# Altium schematic sheet PowerSupply.SchDoc: РППУ
size 420 x 297 mm; ApprovedBy: Коровин; CheckedBy: Коровин; DrawnBy: Овчинников; DocumentNumber: ВКА.821011.000.ПЗ; Scale: {Мш.}; PageSetup: Record=PageOptions|CenterHorizontal=False|CenterVertical=False|PrintScale=0.70|XCorrection=0.00|YCorrection=0.00|PrintKind=1|BorderSize=5000000|LeftOffset=0|BottomOffset=0|Orientation=2|PaperLength=1000|PaperWidth=1000|Scale=100|PaperSource=15|PrintQuality=-3|MediaType=1|DitherType=10|PrintScaleMode=1|PaperKind=A4|PaperIndex=9; Mass: {М.}; DocumentType: Схема электрическая; Rule: PcbType=ProtelPcb
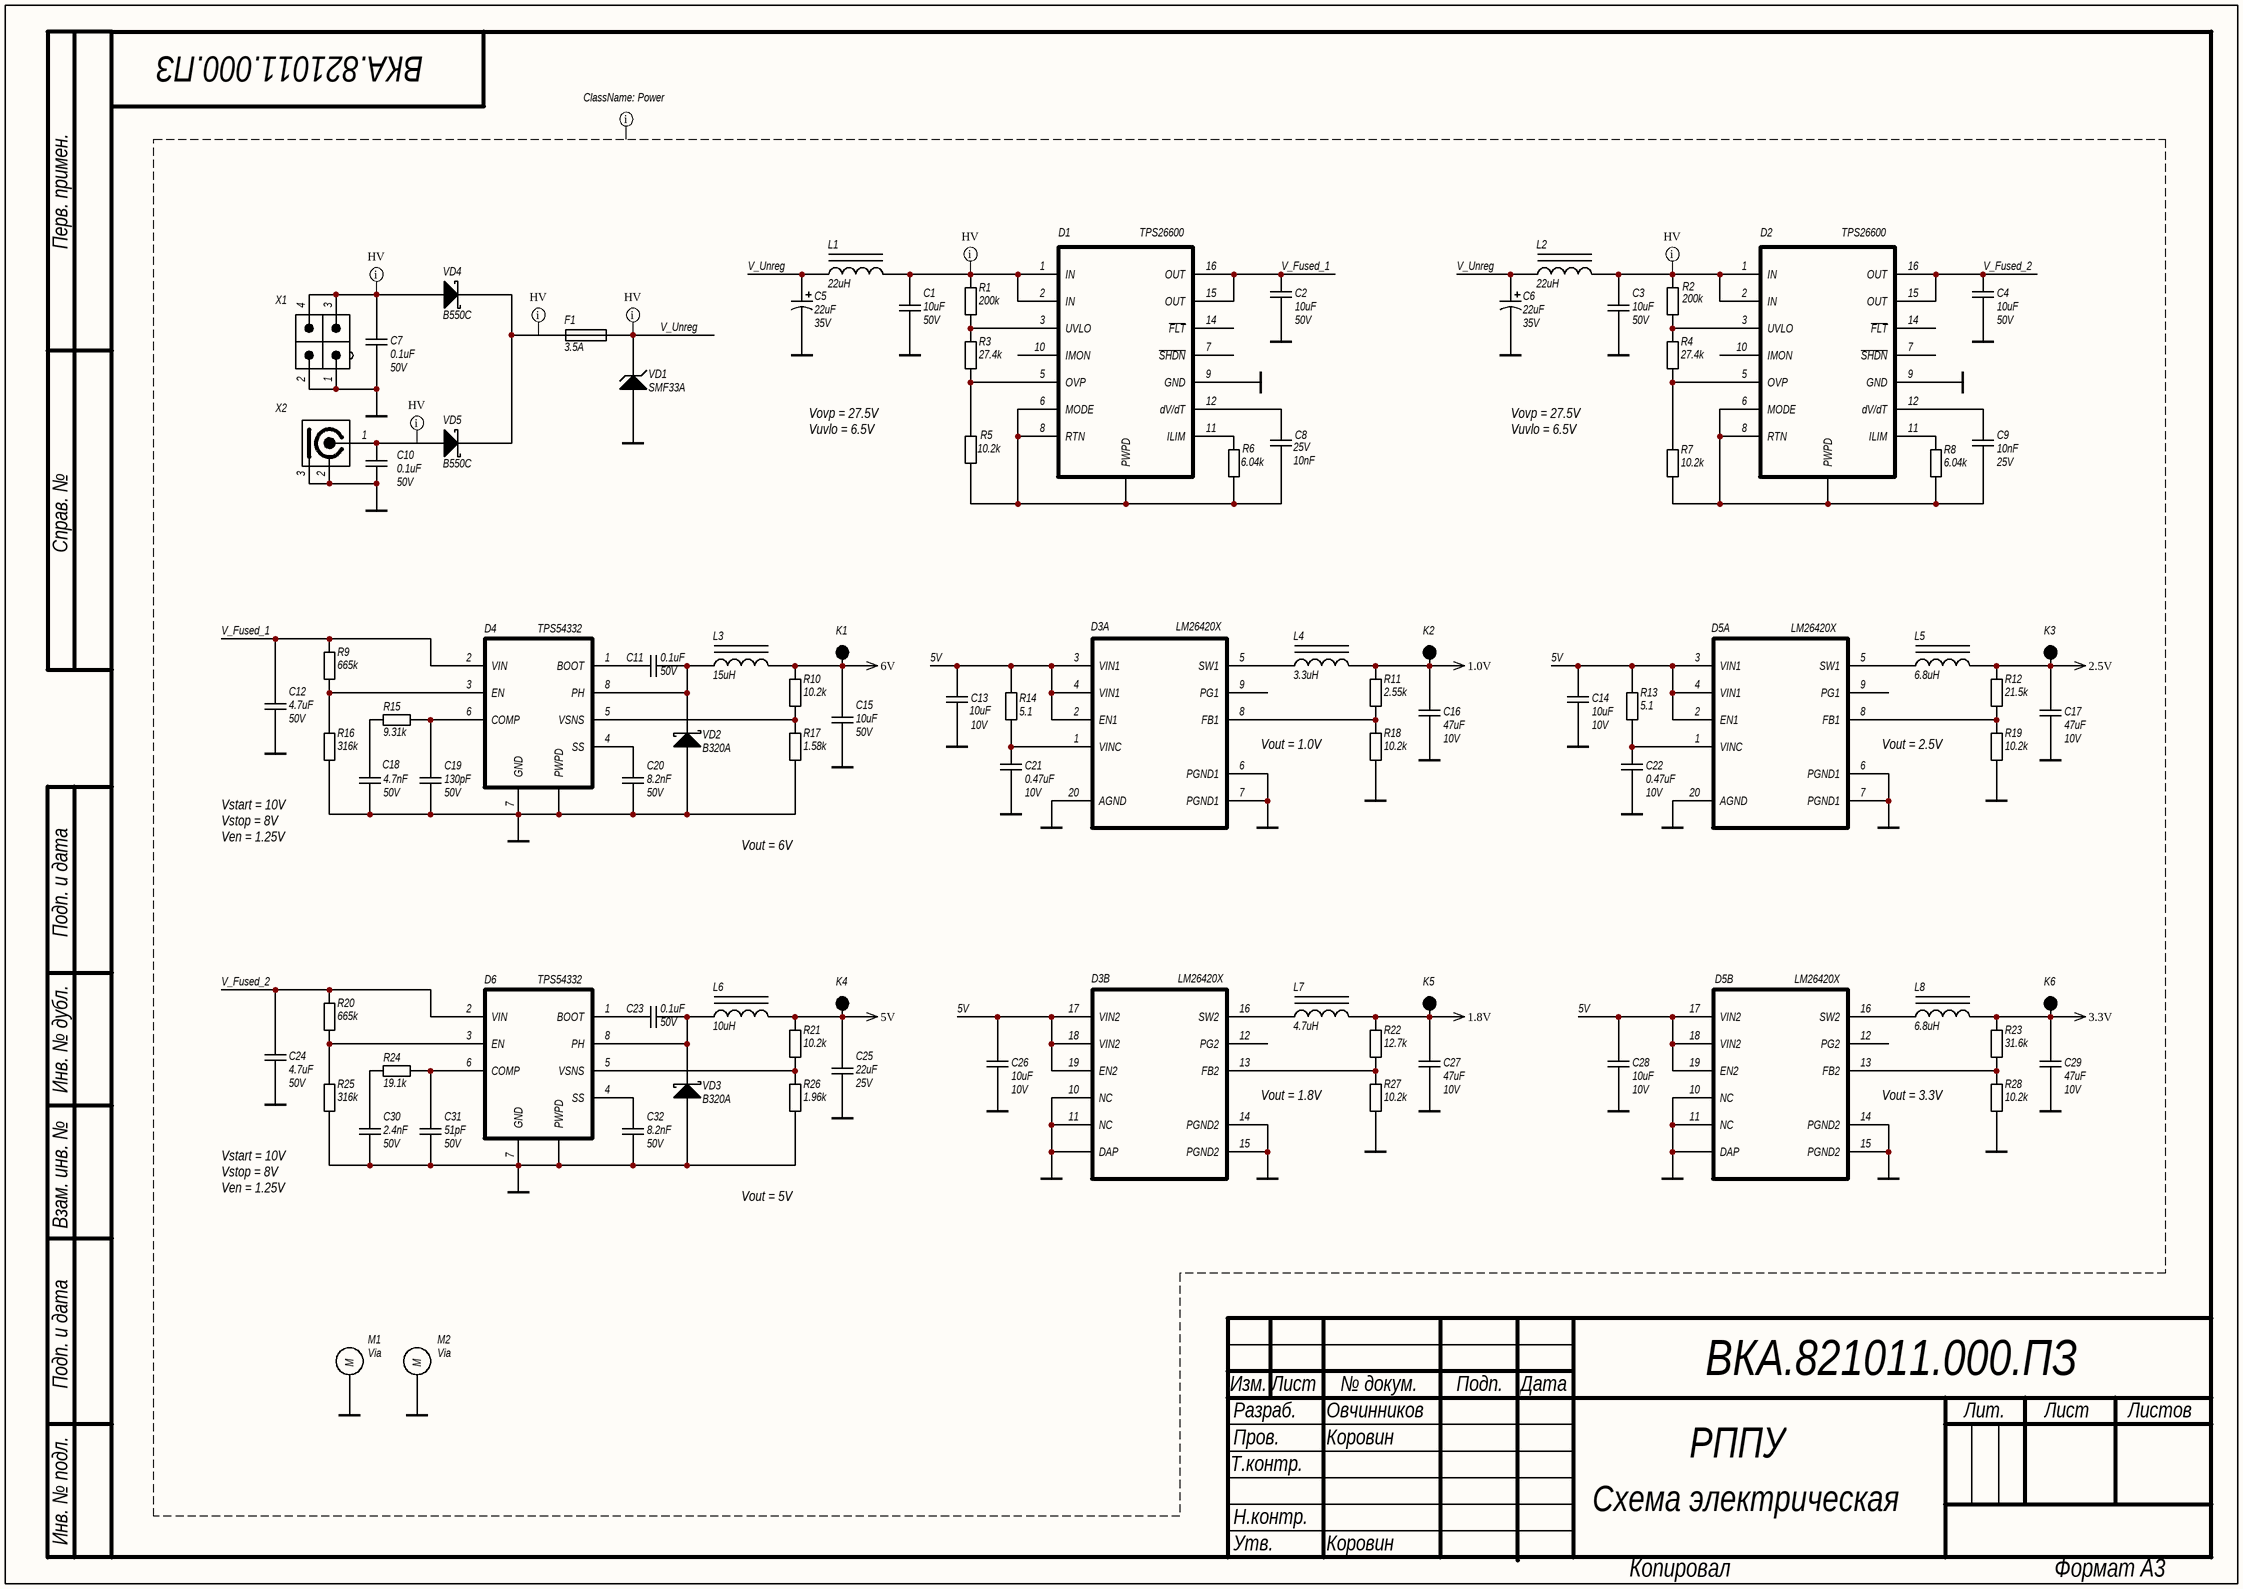
[diagram p0: PowerSupply.SchDoc]

## Parts
C1  value 10uF  Voltage: 50V  [C1210]  (hidden comment: CAP uF)
C2  value 10uF  Voltage: 50V  [C1210]  (hidden comment: CAP uF)
C3  value 10uF  Voltage: 50V  [C1210]  (hidden comment: CAP uF)
C4  value 10uF  Voltage: 50V  [C1210]  (hidden comment: CAP uF)
C5  value 22uF  Voltage: 35V  [Tantalum_D]  (hidden comment: Cap Polarity)
C6  value 22uF  Voltage: 35V  [Tantalum_D]  (hidden comment: Cap Polarity)
C7  value 0.1uF  Voltage: 50V  [C0402]  (hidden comment: CAP)
C8  value 10nF  Voltage: 25V  [C0402]  (hidden comment: CAP)
C9  value 10nF  Voltage: 25V  [C0402]  (hidden comment: CAP)
C10  value 0.1uF  Voltage: 50V  [C0402]  (hidden comment: CAP)
C11  value 0.1uF  Voltage: 50V  [C0402]  (hidden comment: CAP)
C12  value 4.7uF  Voltage: 50V  [C0805]  (hidden comment: CAP uF)
C13  value 10uF  Voltage: 10V  [C0805]  (hidden comment: CAP uF)
C14  value 10uF  Voltage: 10V  [C0805]  (hidden comment: CAP uF)
C15  value 10uF  Voltage: 50V  [C1210]  (hidden comment: CAP uF)
C16  value 47uF  Voltage: 10V  [C1210]  (hidden comment: CAP uF)
C17  value 47uF  Voltage: 10V  [C1210]  (hidden comment: CAP uF)
C18  value 4.7nF  Voltage: 50V  [C0603]  (hidden comment: CAP)
C19  value 130pF  Voltage: 50V  [C0402]  (hidden comment: CAP)
C20  value 8.2nF  Voltage: 50V  [C0402]  (hidden comment: CAP)
C21  value 0.47uF  Voltage: 10V  [C0603]  (hidden comment: CAP)
C22  value 0.47uF  Voltage: 10V  [C0603]  (hidden comment: CAP)
C23  value 0.1uF  Voltage: 50V  [C0402]  (hidden comment: CAP)
C24  value 4.7uF  Voltage: 50V  [C0805]  (hidden comment: CAP uF)
C25  value 22uF  Voltage: 25V  [C1210]  (hidden comment: CAP uF)
C26  value 10uF  Voltage: 10V  [C0805]  (hidden comment: CAP uF)
C27  value 47uF  Voltage: 10V  [C1210]  (hidden comment: CAP uF)
C28  value 10uF  Voltage: 10V  [C0805]  (hidden comment: CAP uF)
C29  value 47uF  Voltage: 10V  [C1210]  (hidden comment: CAP uF)
C30  value 2.4nF  Voltage: 50V  [C0603]  (hidden comment: CAP)
C31  value 51pF  Voltage: 50V  [C0402]  (hidden comment: CAP)
C32  value 8.2nF  Voltage: 50V  [C0402]  (hidden comment: CAP)
D1  TPS26600  [R-PDSO-G16]
D2  TPS26600  [R-PDSO-G16]
D3  LM26420X  [HTSSOP-20]  (parts A,B of 2)
D4  TPS54332  [R-PDSO-G8]
D5  LM26420X  [HTSSOP-20]  (parts A,B of 2)
D6  TPS54332  [R-PDSO-G8]
F1  Current: 3.5A  [Fuse]  (hidden comment: FUSE)
K1  6V  [Control Point]  (value not drawn)
K2  1.0V  [Control Point]  (value not drawn)
K3  2.5V  [Control Point]  (value not drawn)
K4  5V  [Control Point]  (value not drawn)
K5  1.8V  [Control Point]  (value not drawn)
K6  3.3V  [Control Point]  (value not drawn)
L1  value 22uH  [XAL6060-223]  (hidden comment: Inductor PWR)
L2  value 22uH  [XAL6060-223]  (hidden comment: Inductor PWR)
L3  value 15uH  [XAL5050]  (hidden comment: Inductor PWR)
L4  value 3.3uH  [XAL4030]  (hidden comment: Inductor PWR)
L5  value 6.8uH  [XAL4030]  (hidden comment: Inductor PWR)
L6  value 10uH  [XAL5050]  (hidden comment: Inductor PWR)
L7  value 4.7uH  [XAL4030]  (hidden comment: Inductor PWR)
L8  value 6.8uH  [XAL4030]  (hidden comment: Inductor PWR)
M1  Via  [Mechanical_Via]
M2  Via  [Mechanical_Via]
R1  value 200k  [R0402]  (hidden comment: RES)
R2  value 200k  [R0402]  (hidden comment: RES)
R3  value 27.4k  [R0402]  (hidden comment: RES)
R4  value 27.4k  [R0402]  (hidden comment: RES)
R5  value 10.2k  [R0402]  (hidden comment: RES)
R6  value 6.04k  [R0402]  (hidden comment: RES)
R7  value 10.2k  [R0402]  (hidden comment: RES)
R8  value 6.04k  [R0402]  (hidden comment: RES)
R9  value 665k  [R0402]  (hidden comment: RES)
R10  value 10.2k  [R0402]  (hidden comment: RES)
R11  value 2.55k  [R0402]  (hidden comment: RES)
R12  value 21.5k  [R0402]  (hidden comment: RES)
R13  value 5.1  [R0402]  (hidden comment: RES)
R14  value 5.1  [R0402]  (hidden comment: RES)
R15  value 9.31k  [R0402]  (hidden comment: RES)
R16  value 316k  [R0402]  (hidden comment: RES)
R17  value 1.58k  [R0402]  (hidden comment: RES)
R18  value 10.2k  [R0402]  (hidden comment: RES)
R19  value 10.2k  [R0402]  (hidden comment: RES)
R20  value 665k  [R0402]  (hidden comment: RES)
R21  value 10.2k  [R0402]  (hidden comment: RES)
R22  value 12.7k  [R0402]  (hidden comment: RES)
R23  value 31.6k  [R0402]  (hidden comment: RES)
R24  value 19.1k  [R0402]  (hidden comment: RES)
R25  value 316k  [R0402]  (hidden comment: RES)
R26  value 1.96k  [R0402]  (hidden comment: RES)
R27  value 10.2k  [R0402]  (hidden comment: RES)
R28  value 10.2k  [R0402]  (hidden comment: RES)
VD1  SMF33A  [SOD-123F]
VD2  B320A  [Diode_SMA]
VD3  B320A  [Diode_SMA]
VD4  B550C  [Diode_SMC]
VD5  B550C  [Diode_SMC]
X1  miniFit  [2x2 PWR_HDR]  (value not drawn)
X2  POWER  [DC_CONNECTOR]  (value not drawn)

## Nets
1.0V: C16.2 K2.1 L4.2 R11.2
1.8V: C27.2 K5.1 L7.2 R22.2
2.5V: C17.2 K3.1 L5.2 R12.2
3.3V: C29.2 K6.1 L8.2 R23.2
5V: C13.2 C14.2 C25.2 C26.2 C28.2 D3.2(EN1) D3.3(VIN1) D3.4(VIN1) D3.17(VIN2) D3.18(VIN2) D3.19(EN2) D5.2(EN1) D5.3(VIN1) D5.4(VIN1) D5.17(VIN2) D5.18(VIN2) D5.19(EN2) K4.1 L6.2 R13.2 R14.1 R21.2
6V: C15.2 K1.1 L3.2 R10.2
GND: C1.1 C2.1 C3.1 C4.1 C5.2 C6.2 C7.1 C10.1 C12.1 C13.1 C14.1 C15.1 C16.1 C17.1 C18.2 C19.1 C20.1 C21.2 C22.1 C24.1 C25.1 C26.1 C27.1 C28.1 C29.1 C30.1 C31.1 C32.1 D1.9(GND) D2.9(GND) D3.6(PGND1) D3.7(PGND1) D3.10(NC) D3.11(NC) D3.14(PGND2) D3.15(PGND2) D3.20(AGND) D3.21(DAP) D4.7(GND) D4.9(PWPD) D5.6(PGND1) D5.7(PGND1) D5.10(NC) D5.11(NC) D5.14(PGND2) D5.15(PGND2) D5.20(AGND) D5.21(DAP) D6.7(GND) D6.9(PWPD) M1.0(M) M2.0(M) R16.1 R17.1 R18.1 R19.1 R25.1 R26.1 R27.1 R28.1 VD1.2(A) VD2.2(A) VD3.2(A) X1.1 X1.2 X2.2(GND) X2.3(GND)
V_Fused_1: C2.2 C12.2 D1.15(OUT) D1.16(OUT) D4.2(VIN) R9.2
V_Fused_2: C4.2 C24.2 D2.15(OUT) D2.16(OUT) D6.2(VIN) R20.2
V_Unreg: C5.1 C6.1 F1.2 L1.1 L2.1 VD1.1(K)
NetC1_2: C1.2 D1.1(IN) D1.2(IN) L1.2 R1.2
NetC3_2: C3.2 D2.1(IN) D2.2(IN) L2.2 R2.1
NetC7_2: C7.2 VD4.2(A) X1.3 X1.4
NetC8_1: C8.1 D1.6(MODE) D1.8(RTN) D1.17(PWPD) R5.2 R6.1
NetC8_2: C8.2 D1.12(dV/dT)
NetC9_1: C9.1 D2.6(MODE) D2.8(RTN) D2.17(PWPD) R7.1 R8.1
NetC9_2: C9.2 D2.12(dV/dT)
NetC10_2: C10.2 VD5.2(A) X2.1(RF)
NetC11_1: C11.1 D4.8(PH) L3.1 VD2.1(K)
NetC11_2: C11.2 D4.1(BOOT)
NetC18_1: C18.1 R15.1
NetC19_2: C19.2 D4.6(COMP) R15.2
NetC20_2: C20.2 D4.4(SS)
NetC21_1: C21.1 D3.1(VINC) R14.2
NetC22_2: C22.2 D5.1(VINC) R13.1
NetC23_1: C23.1 D6.8(PH) L6.1 VD3.1(K)
NetC23_2: C23.2 D6.1(BOOT)
NetC30_2: C30.2 R24.2
NetC31_2: C31.2 D6.6(COMP) R24.1
NetC32_2: C32.2 D6.4(SS)
NetD1_3: D1.3(UVLO) R1.1 R3.2
NetD1_5: D1.5(OVP) R3.1 R5.1
NetD1_11: D1.11(ILIM) R6.2
NetD2_3: D2.3(UVLO) R2.2 R4.2
NetD2_5: D2.5(OVP) R4.1 R7.2
NetD2_11: D2.11(ILIM) R8.2
NetD3_5: D3.5(SW1) L4.1
NetD3_8: D3.8(FB1) R11.1 R18.2
NetD3_13: D3.13(FB2) R22.1 R27.2
NetD3_16: D3.16(SW2) L7.1
NetD4_3: D4.3(EN) R9.1 R16.2
NetD4_5: D4.5(VSNS) R10.1 R17.2
NetD5_5: D5.5(SW1) L5.1
NetD5_8: D5.8(FB1) R12.1 R19.2
NetD5_13: D5.13(FB2) R23.1 R28.2
NetD5_16: D5.16(SW2) L8.1
NetD6_3: D6.3(EN) R20.1 R25.2
NetD6_5: D6.5(VSNS) R21.1 R26.2
NetF1_1: F1.1 VD4.1(K) VD5.1(K)

Not connected (* = marked no-connect by the designer): D1 7(~{SHDN}) 10(IMON) 14(~{FLT}); D2 7(~{SHDN}) 10(IMON) 14(~{FLT}); D3 9(PG1) 12(PG2); D5 9(PG1) 12(PG2)

## Layout directives
net class Power: 1.0V, 1.8V, 2.5V, 3.3V, 5V, 6V, GND, V_Fused_1, V_Fused_2, V_Unreg
net class HV: NetC1_2, NetC3_2, NetC7_2, NetC10_2, NetF1_1, V_Unreg

## Notes on the sheet
- Vovp = 27.5V
  Vuvlo = 6.5V
- Vout = 1.0V
- Vout = 2.5V
- Vstart = 10V
  Vstop = 8V
  Ven = 1.25V
- Vout = 6V
- Vout = 1.8V
- Vout = 3.3V
- Vout = 5V
- Перв. примен.
- Справ. №
- Подп. и дата
- Инв. № дубл.
- Взам. инв. №
- Изм.
- Лист
- № докум.
- Подп.
- Дата
- Т.контр.
- Пров.
- Разраб.
- Лит.
- Листов
- Инв. № подл.
- Н.контр.
- Утв.
- Копировал
- Формат А3

## Library data of the parts
C1-C4 C15 = CAP uF: SMD Capacitor; Manufacturer: Murata; Material: X7R; Tolerance: 10%; Type: Ceramic Capacitor; P/N: GRM32ER71H106KA12L
C5 C6 = Cap Polarity: Tantalum Polarity SMD Capacitor; Manufacturer: AVX Corporation; Name: Tantalum Capacitor; Tolerance: 10%; Type: Tantalum Polarity Cap; P/N: TPSD226K035R0200; Temperature Range: -55…85°C
C7 C10 C11 C23 = CAP: SMD Capacitor; Manufacturer: Murata; Material: X7R; Tolerance: 10%; Type: Ceramic Capacitor; P/N: GRM155R71H104KE14J
C8 C9 = CAP: SMD Capacitor; Manufacturer: Murata; Material: X7R; Tolerance: 5%; Type: Ceramic Capacitor; P/N: GRM155R71E103KA01D
C12 C24 = CAP uF: SMD Capacitor; Manufacturer: Murata; Material: X5R; Tolerance: 20%; Type: Ceramic Capacitor; P/N: GRM21BR61H475KE51L
C13 C14 C26 C28 = CAP uF: SMD Capacitor; Manufacturer: Murata; Material: X5R; Tolerance: 10%; Type: Ceramic Capacitor; P/N: GRM21BR71A106KE51L
C16 C17 C27 C29 = CAP uF: SMD Capacitor; Manufacturer: Murata; Material: X7R; Tolerance: 10%; Type: Ceramic Capacitor; P/N: GRM32ER71A476KE15L
C18 = CAP: SMD Capacitor; Manufacturer: Murata; Material: NP0; Tolerance: 5%; Type: Ceramic Capacitor; P/N: GRM1885C1H472JA01D
C19 = CAP: SMD Capacitor; Manufacturer: Murata; Material: NP0; Tolerance: 5%; Type: Ceramic Capacitor; P/N: GRM1555C1H131JA01D
C20 C32 = CAP: SMD Capacitor; Manufacturer: Murata; Material: X7R; Tolerance: 10%; Type: Ceramic Capacitor; P/N: GRM155R71H822KA88D
C21 C22 = CAP: SMD Capacitor; Manufacturer: Murata; Material: X7R; Tolerance: 10%; Type: Ceramic Capacitor; P/N: GRM188R71A474KA61D
C25 = CAP uF: SMD Capacitor; Manufacturer: Murata; Material: X7R; Tolerance: 10%; Type: Ceramic Capacitor; P/N: GRM32ER71E226KE15L
C30 = CAP: SMD Capacitor; Manufacturer: Murata; Material: NP0; Tolerance: 5%; Type: Ceramic Capacitor; P/N: GRM1885C1H242JA01D
C31 = CAP: SMD Capacitor; Manufacturer: Murata; Material: NP0; Tolerance: 5%; Type: Ceramic Capacitor; P/N: GRM1555C1H510JA01D
D1 D2 = TPS26600: Industrial eFuse; Current: 2A; Voltage: 60V; Name: TPS26600; Package: 16-Pin SOIC PowerPAD; Temperature Range: −40°C to + 125°C; Type: Industrial eFuse
D3 D5 = LM26420X: Synchronous  DC-DC Converter; Current: 2A; Frequency: 2.2MHz; Input Voltage: 3 V to 5.5 V; Name: LM26420X; Package: HTSSOP 20; Temperature Range: −40°C to + 150°C; Type: Synchronous DC-DC Converter
D4 D6 = TPS54332: Step-Down DC-DC Converter; Current: 3.5A; Frequency: 1MHz; Input Voltage: 3.5V to 28V; Name: TPS54332; Package: 8-Pin SOIC PowerPAD; Temperature Range: −40°C to + 150°C; Type: Step-Down DC-DC Converter
F1 = FUSE: Chip SMD Fuse; Name: Fast Fuse; Type: Fast Chip SMD Fuse; Voltage: 125V; Package: SMD Omni Block
K1-K6 = Test  Point
L1 L2 = Inductor PWR: Magnetic-Core Inductor; Manufacturer: Coilcraft; Name: XAL6060-223MEB; Current: 5A; Tolerance: ±30%; Temperature Range: -40ºC to 125ºC
L3 = Inductor PWR: Magnetic-Core Inductor; Manufacturer: Coilcraft; Name: XAL5050-153MEB; Current: 5A; Tolerance: ±30%; Temperature Range: -40ºC to 125ºC
L4 = Inductor PWR: Magnetic-Core Inductor; Manufacturer: Coilcraft; Name: XEL4030-332MEB; Current: 5A; Tolerance: ±30%; Temperature Range: -40ºC to 125ºC
L5 L8 = Inductor PWR: Magnetic-Core Inductor; Manufacturer: Coilcraft; Name: XEL4030-682MEB; Current: 5A; Tolerance: ±30%; Temperature Range: -40ºC to 125ºC
L6 = Inductor PWR: Magnetic-Core Inductor; Manufacturer: Coilcraft; Name: XAL5050-103MEB; Current: 5A; Tolerance: ±30%; Temperature Range: -40ºC to 125ºC
L7 = Inductor PWR: Magnetic-Core Inductor; Manufacturer: Coilcraft; Name: XEL4030-472MEB; Current: 5A; Tolerance: ±30%; Temperature Range: -40ºC to 125ºC
M1 M2 = Mechanical Via
R1 R2 = RES: SMD Resistor; Manufacturer: Panasonic Electronic Components; Name: Chip SMD Resistor; Power: 0.062 Wt; Tolerance: 1%; P/N: ERJ-2RKF2003X; Temperature Range: -55…155°C
R3 R4 = RES: SMD Resistor; Manufacturer: Panasonic Electronic Components; Name: Chip SMD Resistor; Power: 0.062 Wt; Tolerance: 1%; P/N: ERJ-2RKF2742X; Temperature Range: -55…155°C
R5 R7 R10 R18 R19 R21 R27 R28 = RES: SMD Resistor; Manufacturer: Panasonic Electronic Components; Name: Chip SMD Resistor; Power: 0.062 Wt; Tolerance: 1%; P/N: ERJ-2RKF1022X; Temperature Range: -55…155°C
R6 R8 = RES: SMD Resistor; Manufacturer: Panasonic Electronic Components; Name: Chip SMD Resistor; Power: 0.062 Wt; Tolerance: 1%; P/N: ERJ-2RKF6041X; Temperature Range: -55…155°C
R9 R20 = RES: SMD Resistor; Manufacturer: Panasonic Electronic Components; Name: Chip SMD Resistor; Power: 0.062 Wt; Tolerance: 1%; P/N: ERJ-2RKF6653X; Temperature Range: -55…155°C
R11 = RES: SMD Resistor; Manufacturer: Panasonic Electronic Components; Name: Chip SMD Resistor; Power: 0.062 Wt; Tolerance: 1%; P/N: ERJ-2RKF2551X; Temperature Range: -55…155°C
R12 = RES: SMD Resistor; Manufacturer: Panasonic Electronic Components; Name: Chip SMD Resistor; Power: 0.062 Wt; Tolerance: 1%; P/N: ERJ-2RKF2152X; Temperature Range: -55…155°C
R13 R14 = RES: SMD Resistor; Manufacturer: Panasonic Electronic Components; Name: Chip SMD Resistor; Power: 0.062 Wt; Tolerance: 5%; P/N: ERJ-2GEJ5R1X; Temperature Range: -55…155°C
R15 = RES: SMD Resistor; Manufacturer: Panasonic Electronic Components; Name: Chip SMD Resistor; Power: 0.062 Wt; Tolerance: 1%; P/N: ERJ-2RKF9311X; Temperature Range: -55…155°C
R16 R25 = RES: SMD Resistor; Manufacturer: Panasonic Electronic Components; Name: Chip SMD Resistor; Power: 0.062 Wt; Tolerance: 1%; P/N: ERJ-2RKF3163X; Temperature Range: -55…155°C
R17 = RES: SMD Resistor; Manufacturer: Panasonic Electronic Components; Name: Chip SMD Resistor; Power: 0.062 Wt; Tolerance: 1%; P/N: ERJ-2RKF1581X; Temperature Range: -55…155°C
R22 = RES: SMD Resistor; Manufacturer: Panasonic Electronic Components; Name: Chip SMD Resistor; Power: 0.062 Wt; Tolerance: 1%; P/N: ERJ-2RKF1272X; Temperature Range: -55…155°C
R23 = RES: SMD Resistor; Manufacturer: Panasonic Electronic Components; Name: Chip SMD Resistor; Power: 0.062 Wt; Tolerance: 1%; P/N: ERJ-2RKF3162X; Temperature Range: -55…155°C
R24 = RES: SMD Resistor; Manufacturer: Panasonic Electronic Components; Name: Chip SMD Resistor; Power: 0.062 Wt; Tolerance: 1%; P/N: ERJ-2RKF1912X; Temperature Range: -55…155°C
R26 = RES: SMD Resistor; Manufacturer: Panasonic Electronic Components; Name: Chip SMD Resistor; Power: 0.062 Wt; Tolerance: 1%; P/N: ERJ-2RKF1961X; Temperature Range: -55…155°C
VD1 = TVS: TVS Diode; Manufacturer: Littelfuse; Power: 200W; Voltage: 33V; Name: SMF33A; Package: SOD-123F
VD2-VD5 = Shottky: Schottky Diode; Package: SMC
  VD2 VD3: Name: B320A
  VD4 VD5: Name: B550C
X1 = HDR 2x2 miniFit: 2x2 miniFit DC Power Connector; Current: 5A; Name: Mini-Fit Power Connector; Voltage: 12V; Type: 2x2
X2 = Connector DC: DC Power Connector 6mm; Current: 5A; Voltage: 12V; Name: DC Power Connector; Package: Trough Hole; Type: 2.5mm*5.7mm